# Altium schematic sheet Flight_Computer.SchDoc
size Letter; Organization: Altium Limited; Address1: L3, 12a Rodborough Rd; Address2: Frenchs Forest; Address3: NSW; Address4: Australia 2086
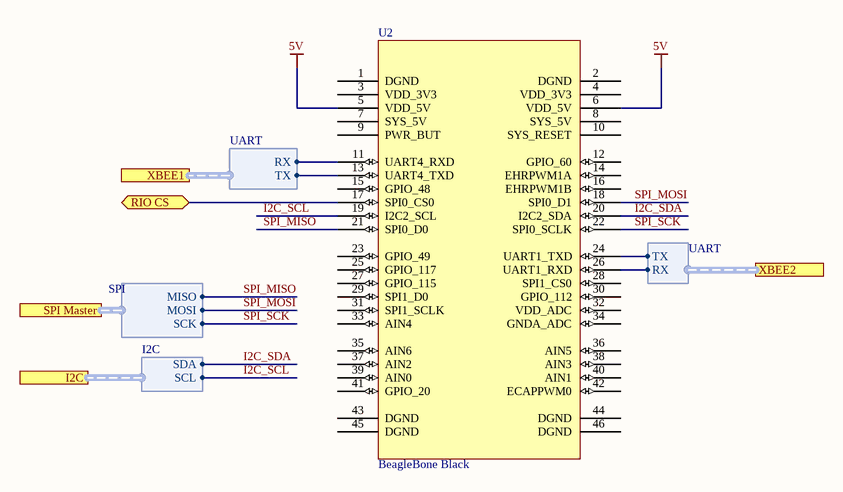
[diagram p0: Flight_Computer.SchDoc]

## Parts
U2  BeagleBone Black  [BeagleBoneBlack]

## Ports
I2C (harness I2C), RIO CS (bidir), SPI Master (harness SPI), XBEE1 (harness UART), XBEE2 (harness UART)

## Harnesses
SPI: MISO, MOSI, SCK
UART: TX, RX
I2C: SCL, SDA
UART: RX, TX

## Nets
5V: U2.5(VDD_5V) U2.6(VDD_5V)
I2C_SCL: U2.19(I2C2_SCL) ; port I2C.SCL
I2C_SDA: U2.20(I2C2_SDA) ; port I2C.SDA
RIO CS: U2.17(SPI0_CS0) ; port RIO CS
SPI_MISO: U2.21(SPI0_D0) ; port SPI Master.MISO
SPI_MOSI: U2.18(SPI0_D1) ; port SPI Master.MOSI
SPI_SCK: U2.22(SPI0_SCLK) ; port SPI Master.SCK
NetU2_11: U2.11(UART4_RXD) ; port XBEE1.RX
NetU2_13: U2.13(UART4_TXD) ; port XBEE1.TX
NetU2_24: U2.24(UART1_TXD) ; port XBEE2.TX
NetU2_26: U2.26(UART1_RXD) ; port XBEE2.RX

Not connected (* = marked no-connect by the designer): U2 1(DGND) 2(DGND) 3(VDD_3V3) 4(VDD_3V3) 7(SYS_5V) 8(SYS_5V) 9(PWR_BUT) 10(SYS_RESET) 12(GPIO_60) 14(EHRPWM1A) 15(GPIO_48) 16(EHRPWM1B) 23(GPIO_49) 25(GPIO_117) 27(GPIO_115) 28(SPI1_CS0) 29(SPI1_D0) 30(GPIO_112) 31(SPI1_SCLK) 32(VDD_ADC) 33(AIN4) 34(GNDA_ADC) 35(AIN6) 36(AIN5) 37(AIN2) 38(AIN3) 39(AIN0) 40(AIN1) 41(GPIO_20) 42(ECAPPWM0) 43(DGND) 44(DGND) 45(DGND) 46(DGND)

## Notes on the sheet
- Title
- Size:
- Date:
- Letter
- Number:
- Time:
- Revision:
- Sheet
- of
- File:

## Library data of the parts
U2 = BeagleBone_Black: P9 Header of a BeagleBone Black